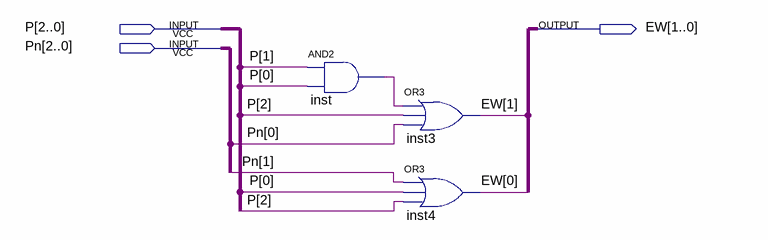
[diagram p0: schematic sheet]
// Quartus schematic EastWest.bdf as structural Verilog: 3 symbols, 3 pins
module EastWest (
  input  [2:0] P,
  input  [2:0] Pn,
  output [1:0] EW
);

  wire inst_out;

  and inst (inst_out, P[1], P[0]);
  or inst3 (EW[1], inst_out, P[2], Pn[0]);
  or inst4 (EW[0], Pn[1], P[0], P[2]);
endmodule
